# Altium schematic sheet SHT_8_Ext_Headers_07349-R5_L10.SchDoc
size B; CompanyName: Microchip Technology Inc.; Organization: Microchip Technology; Address1: 2355 West Chandler Blvd.; Address2: Chandler, AZ  85224; Address4: USA; SheetNumber: 8; SheetTotal: 9; SheetTitle: Extension Connectors; Time: Time
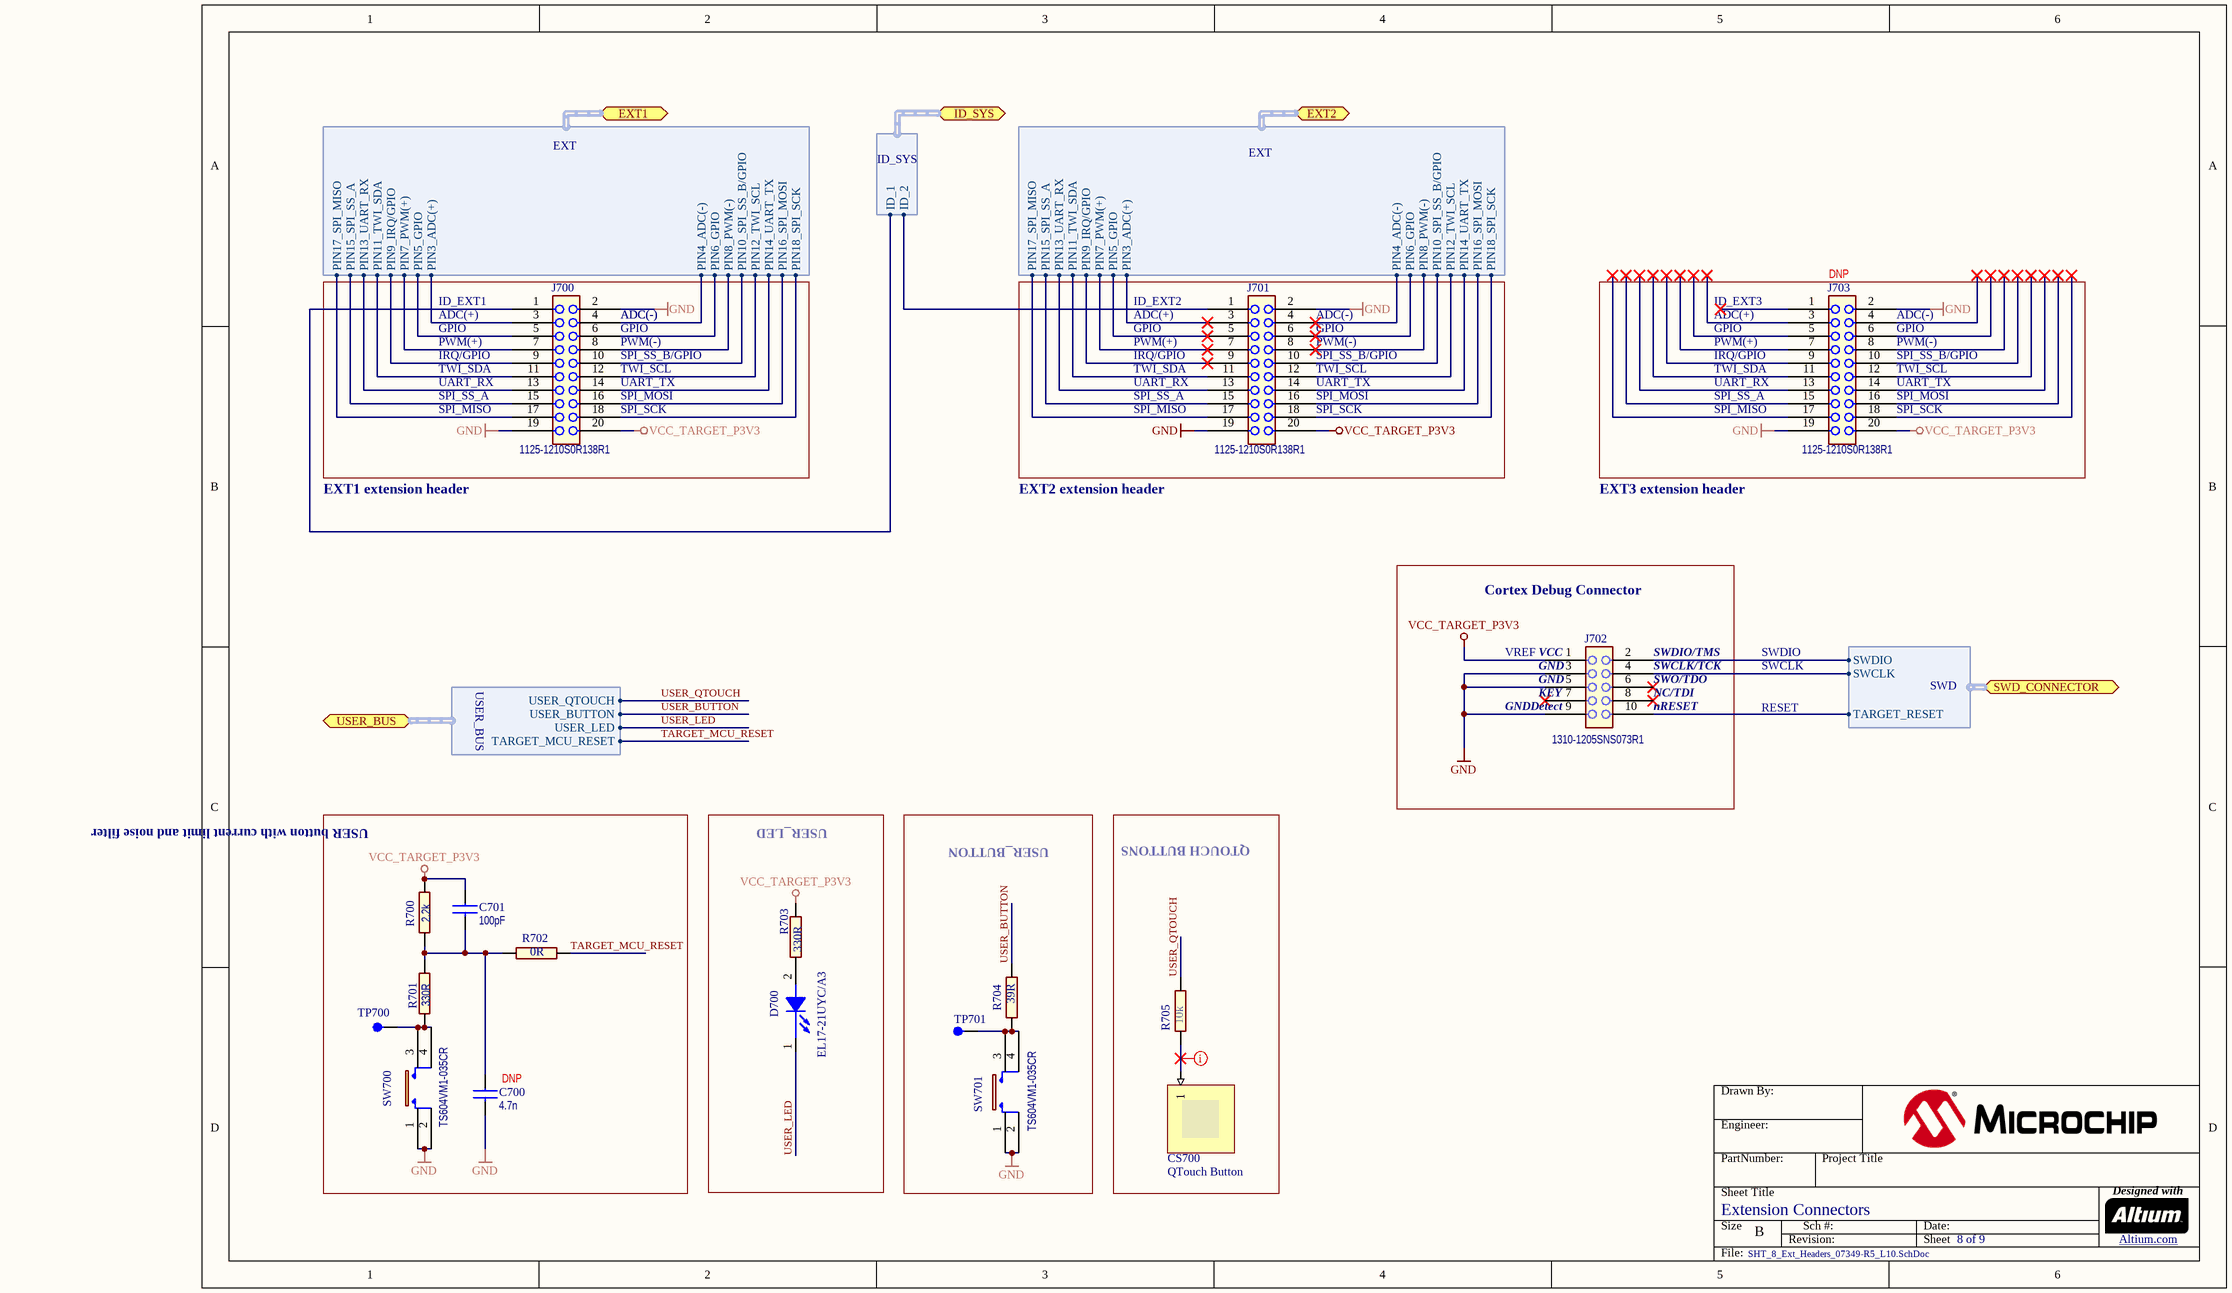
[diagram p0: SHT_8_Ext_Headers_07349-R5_L10.SchDoc]

## Parts
?  (no value)  (graphical)
C700  value 4.7n  Placement: DNP  [AP1-00053]
C701  value 100pF  [AP1-00001]  (hidden comment: CAP-NONPOL)
CS700  QTouch Button  (no BOM)
D700  value EL17-21UYC/A3  [AP4-00013]
J700  value 1125-1210S0R138R1  [AP8-01078]  (hidden comment: HEADER 2x10)
J701  value 1125-1210S0R138R1  [AP8-01078]  (hidden comment: HEADER 2x10)
J702  MPN: 1310-1205SNS073R1  [AP8-01092]  (hidden comment: HEADER 2x5)
J703  value 1125-1210S0R138R1  Placement: DNP  [AP8-01078]  (hidden comment: HEADER 2x10)
R700  value 2.2k  [AP2-00000]
R701  value 330R  [AP2-00000]
R702  value 0R  [AP2-00000]
R703  value 330R  [AP2-00011]
R704  value 39R  [AP2-00011]
R705  value 10k  [AP2-00011]
SW700  value TS604VM1-035CR  [AP8-00137]  (hidden comment: Rating: DC 12V 50mA / Max 0.1 ohm contact resistance)
SW701  value TS604VM1-035CR  [AP8-00137]  (hidden comment: Rating: DC 12V 50mA / Max 0.1 ohm contact resistance)
TP700  (no value)  [AP8-00010]  (no BOM)
TP701  (no value)  [AP8-00010]  (no BOM)

## Blocks framed on the sheet
Cortex Debug Connector: J702
USER button with current limit and noise filter: C700 C701 R700-R702 SW700 TP700
USER_LED: D700 R703
USER_BUTTON: R704 SW701 TP701
QTOUCH BUTTONS: CS700 R705

## Ports
EXT1 (harness EXT), EXT2 (harness EXT), ID_SYS (harness ID_SYS), SWD_CONNECTOR (harness SWD), USER_BUS (harness USER_BUS)

## Harnesses
ID_SYS: ID_1, ID_2
EXT: PIN3_ADC(+), PIN4_ADC(-), PIN5_GPIO, PIN6_GPIO, PIN7_PWM(+), PIN8_PWM(-), PIN9_IRQ/GPIO, PIN10_SPI_SS_B/GPIO, PIN11_TWI_SDA, PIN12_TWI_SCL, PIN13_UART_RX, PIN14_UART_TX, PIN15_SPI_SS_A, PIN16_SPI_MOSI, PIN17_SPI_MISO, PIN18_SPI_SCK
SWD: SWCLK, SWDIO, TARGET_RESET
USER_BUS: USER_QTOUCH, USER_BUTTON, USER_LED, TARGET_MCU_RESET

## Nets
GND: C700.2 J700.2 J700.19 J701.2 J701.19 J702.3 J702.5 J702.9 J703.2 J703.19 SW700.1 SW700.2 SW701.1 SW701.2
VCC_TARGET_P3V3: C701.1 J700.20 J701.20 J702.1 J703.20 R700.2 R703.2
TARGET_MCU_RESET: R702.1 ; port USER_BUS.TARGET_MCU_RESET
USER_BUTTON: R704.2 ; port USER_BUS.USER_BUTTON
USER_LED: D700.1(CATHODE) ; port USER_BUS.USER_LED
USER_QTOUCH: R705.2 ; port USER_BUS.USER_QTOUCH
NetC700_1: C700.1 C701.2 R700.1 R701.2 R702.2
NetCS700_1: CS700.1 R705.1
NetD700_2: D700.2(ANODE) R703.1
NetJ700_1: J700.1 ; port ID_SYS.ID_1
NetJ700_3: J700.3 ; port EXT1.PIN3_ADC(+)
NetJ700_4: J700.4 ; port EXT1.PIN4_ADC(-)
NetJ700_5: J700.5 ; port EXT1.PIN5_GPIO
NetJ700_6: J700.6 ; port EXT1.PIN6_GPIO
NetJ700_7: J700.7 ; port EXT1.PIN7_PWM(+)
NetJ700_8: J700.8 ; port EXT1.PIN8_PWM(-)
NetJ700_9: J700.9 ; port EXT1.PIN9_IRQ/GPIO
NetJ700_10: J700.10 ; port EXT1.PIN10_SPI_SS_B/GPIO
NetJ700_11: J700.11 ; port EXT1.PIN11_TWI_SDA
NetJ700_12: J700.12 ; port EXT1.PIN12_TWI_SCL
NetJ700_13: J700.13 ; port EXT1.PIN13_UART_RX
NetJ700_14: J700.14 ; port EXT1.PIN14_UART_TX
NetJ700_15: J700.15 ; port EXT1.PIN15_SPI_SS_A
NetJ700_16: J700.16 ; port EXT1.PIN16_SPI_MOSI
NetJ700_17: J700.17 ; port EXT1.PIN17_SPI_MISO
NetJ700_18: J700.18 ; port EXT1.PIN18_SPI_SCK
NetJ701_1: J701.1 ; port ID_SYS.ID_2
NetJ701_3: J701.3 ; port EXT2.PIN3_ADC(+)
NetJ701_4: J701.4 ; port EXT2.PIN4_ADC(-)
NetJ701_5: J701.5 ; port EXT2.PIN5_GPIO
NetJ701_6: J701.6 ; port EXT2.PIN6_GPIO
NetJ701_7: J701.7 ; port EXT2.PIN7_PWM(+)
NetJ701_8: J701.8 ; port EXT2.PIN8_PWM(-)
NetJ701_9: J701.9 ; port EXT2.PIN9_IRQ/GPIO
NetJ701_10: J701.10 ; port EXT2.PIN10_SPI_SS_B/GPIO
NetJ701_11: J701.11 ; port EXT2.PIN11_TWI_SDA
NetJ701_12: J701.12 ; port EXT2.PIN12_TWI_SCL
NetJ701_13: J701.13 ; port EXT2.PIN13_UART_RX
NetJ701_14: J701.14 ; port EXT2.PIN14_UART_TX
NetJ701_15: J701.15 ; port EXT2.PIN15_SPI_SS_A
NetJ701_16: J701.16 ; port EXT2.PIN16_SPI_MOSI
NetJ701_17: J701.17 ; port EXT2.PIN17_SPI_MISO
NetJ701_18: J701.18 ; port EXT2.PIN18_SPI_SCK
NetJ702_2: J702.2 ; port SWD_CONNECTOR.SWDIO
NetJ702_4: J702.4 ; port SWD_CONNECTOR.SWCLK
NetJ702_10: J702.10 ; port SWD_CONNECTOR.TARGET_RESET
NetR701_1: R701.1 SW700.3 SW700.4 TP700.1
NetR704_1: R704.1 SW701.3 SW701.4 TP701.1

Not connected (* = marked no-connect by the designer): J702 6* 7* 8*; J703 1* 3* 4* 5* 6* 7* 8* 9* 10* 11* 12* 13* 14* 15* 16* 17* 18*

## Layout directives
rule Assembly Testpoint Usage [Testpoint - Not Allowed    Multiple - Not Allowed]: NetCS700_1

## Notes on the sheet
- ID_EXT1
- ADC(+)
- GPIO
- PWM(+)
- IRQ/GPIO
- TWI_SDA
- (near J700) ADC(-)
- (near J700) GPIO
- (near J700) PWM(-)
- (near J700) SPI_SS_B/GPIO
- (near J700) TWI_SCL
- ID_EXT2
- (near J701) ADC(-)
- (near J701) GPIO
- (near J701) PWM(-)
- (near J701) SPI_SS_B/GPIO
- (near J701) TWI_SCL
- ID_EXT3
- (near J703) ADC(-)
- (near J703) GPIO
- (near J703) PWM(-)
- (near J703) SPI_SS_B/GPIO
- (near J703) TWI_SCL
- UART_RX
- SPI_SS_A
- SPI_MISO
- (near J700) UART_TX
- (near J700) SPI_MOSI
- (near J700) SPI_SCK
- (near J701) UART_TX
- (near J701) SPI_MOSI
- (near J701) SPI_SCK
- (near J703) UART_TX
- (near J703) SPI_MOSI
- (near J703) SPI_SCK
- EXT1 extension header
- EXT2 extension header
- EXT3 extension header
- VREF
- (near J702) VCC
- (near J702) GND
- (near J702) KEY
- (near J702) SWDIO/TMS
- (near J702) SWCLK/TCK
- (near J702) SWO/TDO
- (near J702) NC/TDI
- SWDIO
- SWCLK
- RESET
- (near J702) GNDDetect
- (near J702) nRESET
- Drawn By:
- Engineer:
- PartNumber:
- Project Title
- Sheet Title
- Size
- B
- Revision:
- Sch #:
- Date:
- Sheet
- Designed with
- Altium.com <http://go.altium.com/MicrochipLandingPage_Evaluation.html>
- File:

## Library data of the parts
? = Title Block B
C700 = A01-0046: Ceramic capacitor, SMD 0402, X7R, 25V, +/-10% (de35287); PartGroup: Capacitors,Ceramic,SMD 0402; Manufacturer: PHYCOMP; MPN: 2238 587 15632; TemperatureRange: -55 - +125 deg C; ComponentStatus: 'Active (verified)'; Status: Active; Verified by: Lars Helge Mo; Verified date: 2005-12-15; AN: A01-0046; Tolerance: 25V, +/-10%; Height: 0.550000011920929; FootprintStatus: 'Active (Verified)'
C701 = A01-0629: Ceramic Capacitor, SMD 0402, COG, 50V, +/-5%; PartGroup: Capacitors,Ceramic,SMD 0402; Manufacturer: Murata; MPN: GRM1555C1H101JA01D; Tolerance: Â±5%; TemperatureRange: -55 Â°C to +125 Â°C; ComponentStatus: 'Active (verified)'; Status: Active; Verified by: Lars Helge Mo; Verified date: 2005-12-15; AN: A01-0629; Height: 0.5; FootprintStatus: 'Active (Verified)'
CS700 = QTouchButton: ConfiguratorName: ATMEL_TOUCH; ConfigurationParameters: {}__sensorid[1]{}width[8]{}height[8]{}
D700 = A10-0019: LED, Yellow, Wave length=591nm, SMD 0805, ±70°; PartGroup: Opto,LEDs,SMD; Manufacturer: Everlight; MPN: 17-21UYC/S530-A3/TR8; TemperatureRange: -40 to +85 deg C; ComponentStatus: 'Active (verified)'; Verified date: 2006-02-17; Verified by: Sveinung Helgeland; Status: Active; AN: A10-0019; Height: 1.10000002384186; FootprintStatus: 'Active (Verified)'
J700 J701 J703 = A08-2786: Pin header, 2x10, Right Angle, 2.54mm, THM, Pin In Paste; PartGroup: Mechanical devices,Connectors,Pin headers; Manufacturer: WCON HARDWARE ELECTRONICS CO., LTD; ComponentStatus: 'Active (verified)'; Status: Active; Verified by: Lars Helge Mo; Verified date: 2005-12-19; AN: A08-2786; Height: 5.15000009536743; MPN: 1125-1210S0R138R1; FootprintStatus: 'Active (Verified)'
J702 = A08-2827: 2x5 pin header, 1.27mm pitch, THM; PartGroup: Mechanical devices,Connectors,Pin headers; Manufacturer: WCON HARDWARE ELECTRONICS CO., LTD; Value: PIN HEADER 2x5; ComponentStatus: 'Active (verified)'; Verified date: 2005-12-19; Verified by: Lars Helge Mo; Status: Active; AN: A08-2827; Height: 4; FootprintStatus: 'Active (Verified)'
R700 = A02-0220: Thick film resistor, SMD 0402, 1/16W, 1%; PartGroup: Resistors,SMD,0402 1%; Manufacturer: ASJ; MPN: CR10-2201-FK; TemperatureRange: -55 - +125 deg C; ComponentStatus: 'Active (verified)'; Status: Active; Verified by: Lars Helge Mo; Verified date: 2005-12-19; AN: A02-0220; Tolerance: 1 %; Height: 0.349999994039536; FootprintStatus: 'Active (Verified)'
R701 R703 = A02-0200: Thick film resistor, SMD 0402, 1/16W, 1%; PartGroup: Resistors,SMD,0402 1%; Manufacturer: ASJ; MPN: CR10-3300-FK; TemperatureRange: -55 - +125 deg C; ComponentStatus: 'Active (verified)'; Status: Active; Verified by: Lars Helge Mo; Verified date: 2005-12-19; AN: A02-0200; Tolerance: 1 %; Height: 0.349999994039536; FootprintStatus: 'Active (Verified)'
R702 = A02-0163: RES 0.0 OHM 1/16W 0402 SMD; PartGroup: Resistors,SMD,0402 1%; Manufacturer: (n/a); MPN: RMCF0402ZT0R00; Tolerance: 1 %; TemperatureRange: -55 - +125 deg C; ComponentStatus: 'Active (verified)'; Status: Active; Verified by: Lars Helge Mo; Verified date: 2005-12-19; AN: A02-0163; Height: 0.349999994039536; FootprintStatus: 'Active (Verified)'
R704 = A02-0178: Thick film resistor, SMD 0402, 1/16W, 1%; PartGroup: Resistors,SMD,0402 1%; Manufacturer: ASJ; MPN: CR10-39R0-FK; TemperatureRange: -55 - +125 deg C; ComponentStatus: 'Active (verified)'; Status: Active; Verified by: Lars Helge Mo; Verified date: 2005-12-19; AN: A02-0178; Tolerance: 1 %; Height: 0.349999994039536; FootprintStatus: 'Active (Verified)'
R705 = A02-0236: Thick film resistor, SMD 0402, 1/16W, 1%; PartGroup: Resistors,SMD,0402 1%; Manufacturer: vishay; MPN: CRCW040210K0FKED; TemperatureRange: -55 - +125 deg C; ComponentStatus: 'Active (verified)'; Status: Active; Verified by: Lars Helge Mo; Verified date: 2005-12-19; AN: A02-0236; Tolerance: 1 %; Height: 0.349999994039536; FootprintStatus: 'Active (Verified)'
SW700 SW701 = A08-2830: SWITCH, SMD, 260gf, 6.4mm X 6.2mm; PartGroup: Mechanical devices,Switches,SMD; Manufacturer: Dailywell Electronics Co.LTD; MPN: TS604VM1-035CR-R; TemperatureRange: -40 - +85 deg C; ComponentStatus: 'Active (verified)'; Status: Active; Verified by: Ketil Skjerve; Verified date: 2006-03-15; AN: A08-2830; Height: 3.5; FootprintStatus: 'Active (Verified)'
TP700 TP701 = A08-0004: Single SMD testpad; PartGroup: Mechanical devices,Connectors,Test points; ComponentStatus: 'Active (verified)'; Status: Active; Verified by: Sveinung Helgeland; Verified date: 2006-02-17; AN: A08-0004; Value: TESTPAD; Height: 0; FootprintStatus: 'Active (Verified)'